# Altium schematic sheet main.SchDoc
size A4; SheetNumber: 1; SheetTotal: 3; SPICEModelCacheCEDLRVCC: <root> / <DocumentId>CEDLRVCC</DocumentId> / </root>
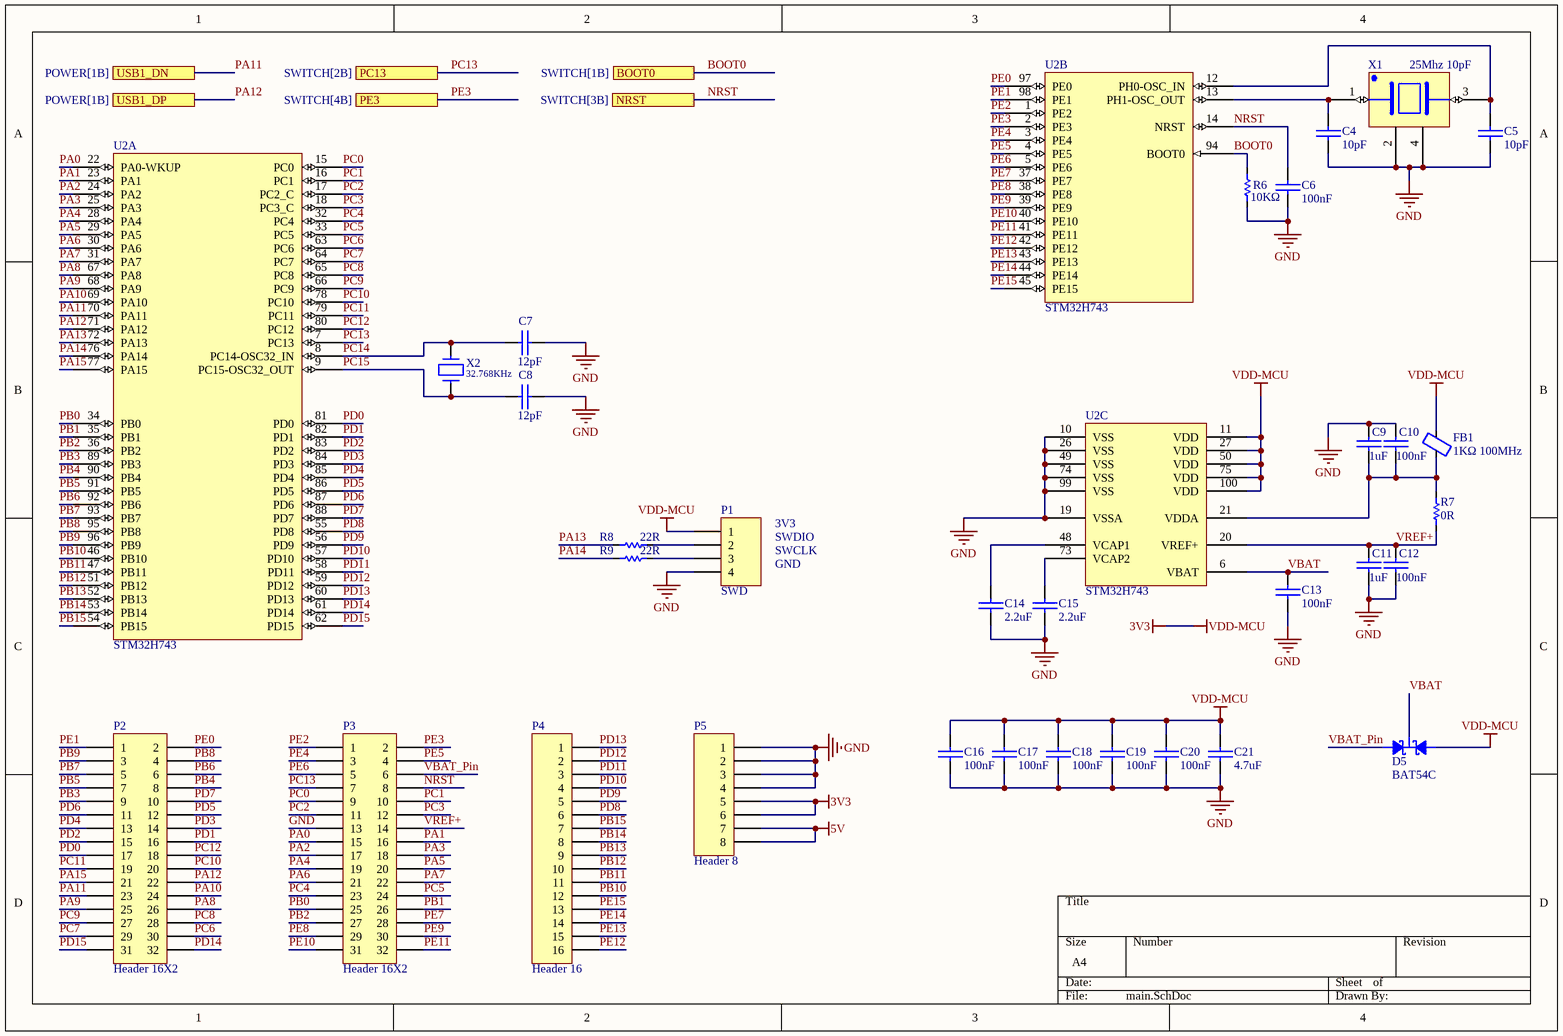
[diagram p0: main.SchDoc]

## Parts
C4  10pF  [0402_Capacitor]
C5  10pF  [0402_Capacitor]
C6  100nF  [0402_Capacitor]
C7  12pF  [0402_Capacitor]
C8  12pF  [0402_Capacitor]
C9  1uF  [0402_Capacitor]
C10  100nF  [0402_Capacitor]
C11  1uF  [0402_Capacitor]
C12  100nF  [0402_Capacitor]
C13  100nF  [0402_Capacitor]
C14  2.2uF  [0402_Capacitor]
C15  2.2uF  [0402_Capacitor]
C16  100nF  [0402_Capacitor]
C17  100nF  [0402_Capacitor]
C18  100nF  [0402_Capacitor]
C19  100nF  [0402_Capacitor]
C20  100nF  [0402_Capacitor]
C21  4.7uF  [0402_Capacitor]
D5  BAT54C  [SOT23_3L]
FB1  1KΩ 100MHz  [0603_Ferrite_Bead]
P1  SWD  [SWD]
P2  Header 16X2  [16x2_Header]
P3  Header 16X2  [16x2_Header]
P4  Header 16  [16x1_Header]
P5  Header 8  [8x1_Header]
R6  10KΩ  [0402_Resistor]
R7  0R  [0402_Resistor]
R8  22R  [0402_Resistor]
R9  22R  [0402_Resistor]
U2  STM32H743  [LQFP100Pin]  (parts A,B,C of 3)
X1  25Mhz 10pF  [XTAL_25MHz]
X2  32.768KHz  [XTAL_32.768KHz]

## Ports
BOOT0 (see SWITCH[1B]), NRST (see SWITCH[3B]), PC13 (see SWITCH[2B]), PE3 (see SWITCH[4B]), USB1_DN (see POWER[1B]), USB1_DP (see POWER[1B])

## Nets
3V3: C16.1 C17.1 C18.1 C19.1 C20.1 C21.1 D5.2 FB1.1 P1.1 P5.5 P5.6 U2.11(VDD) U2.27(VDD) U2.50(VDD) U2.75(VDD) U2.100(VDD)  [also labelled VDD-MCU]
5V: P5.7 P5.8
GND: C4.2 C5.2 C6.2 C7.2 C8.2 C9.1 C10.1 C11.2 C12.2 C13.2 C14.2 C15.2 C16.2 C17.2 C18.2 C19.2 C20.2 C21.2 P1.4 P3.13 P5.1 P5.2 P5.3 P5.4 R6.1 U2.10(VSS) U2.19(VSSA) U2.26(VSS) U2.49(VSS) U2.74(VSS) U2.99(VSS) X1.2 X1.4
BOOT0: R6.2 U2.94(BOOT0) ; port BOOT0
NRST: C6.1 P3.8 U2.14(NRST) ; port NRST
PA0: P3.15 U2.22(PA0-WKUP)
PA1: P3.16 U2.23(PA1)
PA2: P3.17 U2.24(PA2)
PA3: P3.18 U2.25(PA3)
PA4: P3.19 U2.28(PA4)
PA5: P3.20 U2.29(PA5)
PA6: P3.21 U2.30(PA6)
PA7: P3.22 U2.31(PA7)
PA8: P2.26 U2.67(PA8)
PA9: P2.25 U2.68(PA9)
PA10: P2.24 U2.69(PA10)
PA11: P2.23 U2.70(PA11) ; port USB1_DN
PA12: P2.22 U2.71(PA12) ; port USB1_DP
PA13: R8.2 U2.72(PA13)
PA14: R9.2 U2.76(PA14)
PA15: P2.21 U2.77(PA15)
PB0: P3.25 U2.34(PB0)
PB1: P3.26 U2.35(PB1)
PB2: P3.27 U2.36(PB2)
PB3: P2.9 U2.89(PB3)
PB4: P2.8 U2.90(PB4)
PB5: P2.7 U2.91(PB5)
PB6: P2.6 U2.92(PB6)
PB7: P2.5 U2.93(PB7)
PB8: P2.4 U2.95(PB8)
PB9: P2.3 U2.96(PB9)
PB10: P4.12 U2.46(PB10)
PB11: P4.11 U2.47(PB11)
PB12: P4.10 U2.51(PB12)
PB13: P4.9 U2.52(PB13)
PB14: P4.8 U2.53(PB14)
PB15: P4.7 U2.54(PB15)
PC0: P3.9 U2.15(PC0)
PC1: P3.10 U2.16(PC1)
PC2: P3.11 U2.17(PC2_C)
PC3: P3.12 U2.18(PC3_C)
PC4: P3.23 U2.32(PC4)
PC5: P3.24 U2.33(PC5)
PC6: P2.30 U2.63(PC6)
PC7: P2.29 U2.64(PC7)
PC8: P2.28 U2.65(PC8)
PC9: P2.27 U2.66(PC9)
PC10: P2.20 U2.78(PC10)
PC11: P2.19 U2.79(PC11)
PC12: P2.18 U2.80(PC12)
PC13: P3.7 U2.7(PC13) ; port PC13
PC14: C7.1 U2.8(PC14-OSC32_IN) X2.2
PC15: C8.1 U2.9(PC15-OSC32_OUT) X2.1
PD0: P2.17 U2.81(PD0)
PD1: P2.16 U2.82(PD1)
PD2: P2.15 U2.83(PD2)
PD3: P2.14 U2.84(PD3)
PD4: P2.13 U2.85(PD4)
PD5: P2.12 U2.86(PD5)
PD6: P2.11 U2.87(PD6)
PD7: P2.10 U2.88(PD7)
PD8: P4.6 U2.55(PD8)
PD9: P4.5 U2.56(PD9)
PD10: P4.4 U2.57(PD10)
PD11: P4.3 U2.58(PD11)
PD12: P4.2 U2.59(PD12)
PD13: P4.1 U2.60(PD13)
PD14: P2.32 U2.61(PD14)
PD15: P2.31 U2.62(PD15)
PE0: P2.2 U2.97(PE0)
PE1: P2.1 U2.98(PE1)
PE2: P3.1 U2.1(PE2)
PE3: P3.2 U2.2(PE3) ; port PE3
PE4: P3.3 U2.3(PE4)
PE5: P3.4 U2.4(PE5)
PE6: P3.5 U2.5(PE6)
PE7: P3.28 U2.37(PE7)
PE8: P3.29 U2.38(PE8)
PE9: P3.30 U2.39(PE9)
PE10: P3.31 U2.40(PE10)
PE11: P3.32 U2.41(PE11)
PE12: P4.16 U2.42(PE12)
PE13: P4.15 U2.43(PE13)
PE14: P4.14 U2.44(PE14)
PE15: P4.13 U2.45(PE15)
VBAT: C13.1 D5.3 U2.6(VBAT)
VBAT_Pin: D5.1 P3.6
VREF+: C11.1 C12.1 P3.14 R7.1 U2.20(VREF+)
NetC4_1: C4.1 U2.13(PH1-OSC_OUT) X1.1
NetC5_1: C5.1 U2.12(PH0-OSC_IN) X1.3
NetC9_2: C9.2 C10.2 FB1.2 R7.2 U2.21(VDDA)
NetC14_1: C14.1 U2.48(VCAP1)
NetC15_1: C15.1 U2.73(VCAP2)
NetP1_2: P1.2 R8.1
NetP1_3: P1.3 R9.1

## Notes on the sheet
- 3V3
- SWDIO
- SWCLK
- GND

## Library data of the parts
C4-C21 = CAP-Chip: SMDCapacitor
FB1 = FB1
P1 = Header 4H: Header, 4-Pin, Right Angle; LatestRevisionDate: 17-Jul-2002; LatestRevisionNote: Re-released for DXP Platform.; Publisher: Altium Limited
P2 P3 = Header 16X2: Header, 16-Pin, Dual row; LatestRevisionDate: 17-Jul-2002; LatestRevisionNote: Re-released for DXP Platform.; Publisher: Altium Limited
P4 = Header 16: Header, 16-Pin; LatestRevisionDate: 17-Jul-2002; LatestRevisionNote: Re-released for DXP Platform.; Publisher: Altium Limited
P5 = Header 8: Header, 8-Pin; LatestRevisionDate: 17-Jul-2002; LatestRevisionNote: Re-released for DXP Platform.; Publisher: Altium Limited
R6-R9 = Res1: Resistor; Published: 8-Jun-2000; LatestRevisionDate: 17-Jul-2002; LatestRevisionNote: Re-released for DXP Platform.; PackageReference: AXIAL-0.3; Publisher: Altium Limited; PackageDescription: Axial Device, Thru-Hole; 2 Leads; 0.3 in Pin Spacing
X1 = XTAL_25MHz
X2 = CRYSTAL